# Altium schematic sheet Analog.SchDoc
size A; SheetNumber: 1; SheetTotal: 3
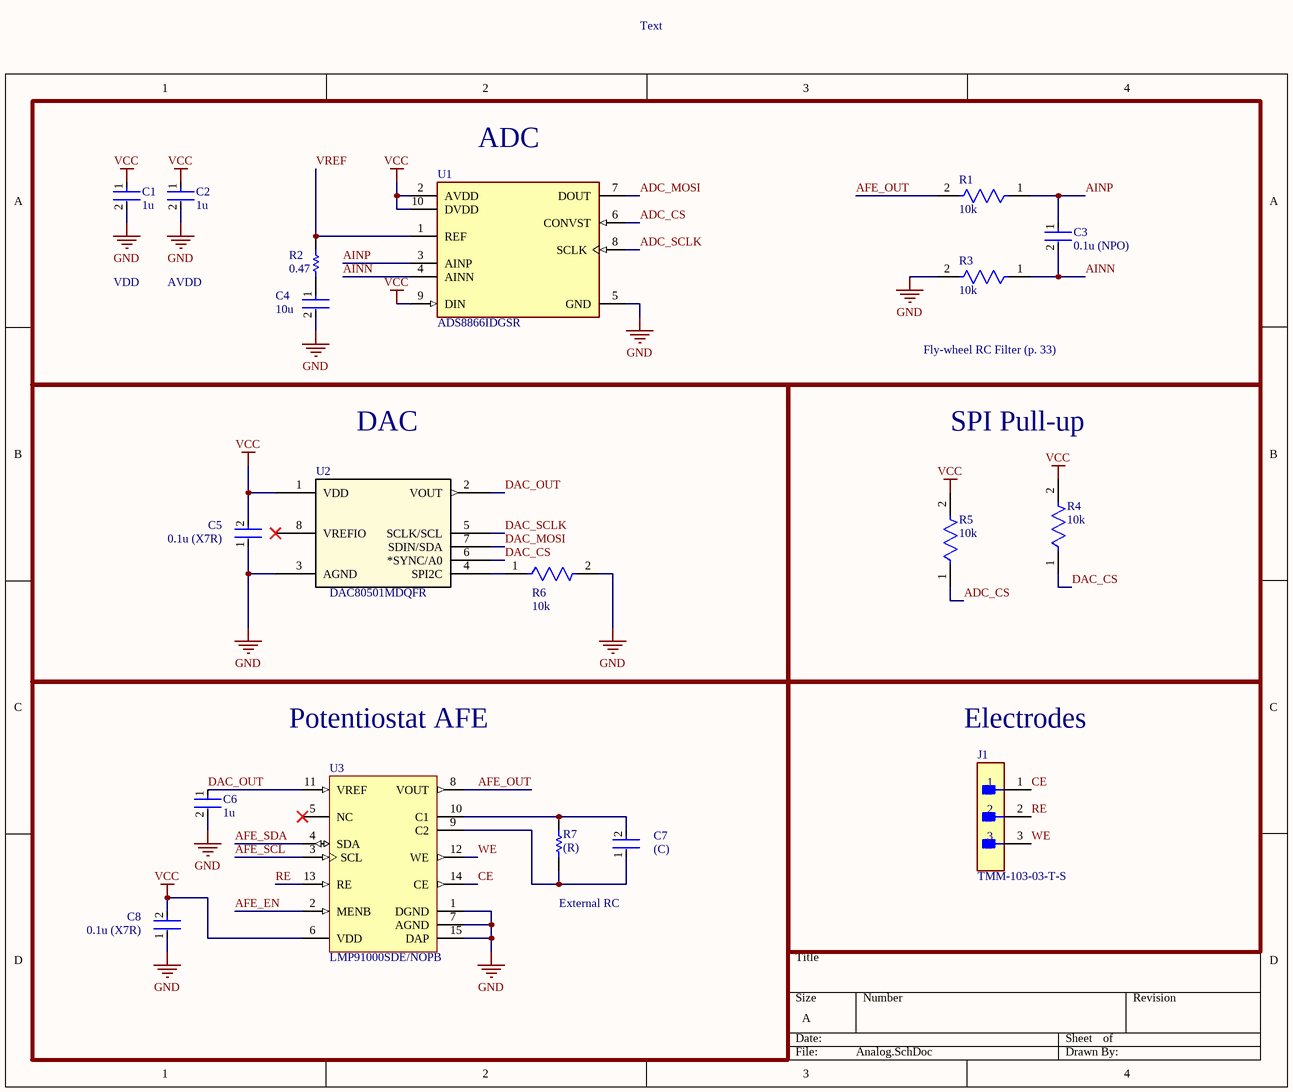
[diagram p0: Analog.SchDoc]

## Parts
C1  1u  [FP-GCM188-0_1-IPC_B]
C2  1u  [FP-GCM188-0_1-IPC_B]
C3  0.1u (NPO)  [FP-GRM319-0_15-MFG]
C4  10u  [FP-GRM21B-0_15-MFG]
C5  0.1u (X7R)  [FP-GCJ188-0_2-IPC_C]
C6  1u  [FP-GCM188-0_1-IPC_B]
C7  (C)  [FP-GCJ188-0_2-IPC_C]
C8  0.1u (X7R)  [FP-GCJ188-0_2-IPC_C]
J1  TMM-103-03-T-S  [FP-TMM-103-03-T-S-MFG]
R1  10k  [FP-CPF0603-MFG]
R2  0.47  [RESC1608X55X30ML15T15]
R3  10k  [FP-CPF0603-MFG]
R4  10k  [FP-CPF0603-MFG]
R5  10k  [FP-CPF0603-MFG]
R6  10k  [FP-CPF0603-MFG]
R7  (R)  [RESC1005X40X25NL05T10]
U1  ADS8866IDGSR  [FP-DGS0010A-IPC_A]
U2  DAC80501MDQFR  [WSON8_2P1X2P1_TEX]
U3  LMP91000SDE/NOPB  [NHL0014B_V]

## Blocks framed on the sheet
ADC: C1-C4 R1-R3 U1
DAC: C5 R6 U2
SPI Pull-up: R4 R5
Potentiostat AFE: C6-C8 R7 U3
Electrodes: J1

## Nets
GND: C1.2 C2.2 C4.2 C5.1 C6.2 C8.1 R3.2 R6.2 U1.5(GND) U2.3(AGND) U3.1(DGND) U3.7(AGND) U3.15(DAP)
VCC: C1.1 C2.1 C5.2 C8.2 R4.2 R5.2 U1.2(AVDD) U1.9(DIN) U1.10(DVDD) U2.1(VDD) U3.6(VDD)
ADC_CS: R5.1 U1.6(CONVST)
ADC_MOSI: U1.7(DOUT)
ADC_SCLK: U1.8(SCLK)
AFE_EN: U3.2(MENB)
AFE_OUT: R1.2 U3.8(VOUT)
AFE_SCL: U3.3(SCL)
AFE_SDA: U3.4(SDA)
AINN: C3.2 R3.1 U1.4(AINN)
AINP: C3.1 R1.1 U1.3(AINP)
CE: J1.1 U3.14(CE)
DAC_CS: R4.1 U2.6(*SYNC/A0)
DAC_MOSI: U2.7(SDIN/SDA)
DAC_OUT: C6.1 U2.2(VOUT) U3.11(VREF)
DAC_SCLK: U2.5(SCLK/SCL)
RE: J1.2 U3.13(RE)
VREF: R2.2 U1.1(REF)
WE: J1.3 U3.12(WE)
NetC4_1: C4.1 R2.1
NetC7_1: C7.1 R7.1 U3.9(C2)
NetC7_2: C7.2 R7.2 U3.10(C1)
NetR6_1: R6.1 U2.4(SPI2C)

Not connected (* = marked no-connect by the designer): U2 8(VREFIO)*; U3 5(NC)*

## Notes on the sheet
- Text
- VDD
- AVDD
- Fly-wheel RC Filter (p. 33)
- External RC

## Library data of the parts
C1 C2 C6 = CMP-2006-02357-2: Ceramic Capacitor for Automotive 1uF  ±10% 16VDC X7R 0603 Paper T/R; Voltage: 16V; Thickness: 0.035inch; Width: 0.031inch; Radiation Hardening: No; Depth: 0.8mm; Max Operating Temperature: 125°C; Package Quantity: 1; Ratings: AEC-Q200; Min Operating Temperature: -55°C; Packaging: Tape and Reel; Case Code (Metric): 1608; REACH SVHC: No SVHC; Dielectric: X7R; Case Code (Imperial): 0603; Length: 1.6mm; Height: 0.8mm; Voltage Rating: 16V; Termination: SMD/SMT; Case/Package: 0603; Voltage Rating (DC): 16V; Tolerance: 10%; Capacitance: 1uF; Mount: Surface Mount; Lead Free: Lead Free
C3 = CMP-06035-028588-1: Chip Multilayer Ceramic Capacitors for General Purpose, 1206, 0.10uF, C0G, 30ppm/°C, 5%, 50V
C4 = CMP-2000-07555-2: Chip Multilayer Ceramic Capacitors for General Purpose, 0805, 10uF, X7R, 15%, 10%, 10V; Length: 2mm; Case Code (Metric): 2012; Height: 1.25mm; Tolerance: 10%; Width: 1.25mm; Voltage Rating: 10V; Voltage Rating (DC): 10V; Case/Package: 0805; Package Quantity: 3000; Capacitance: 10uF; REACH SVHC: No SVHC; Case Code (Imperial): 0805; Min Operating Temperature: -55°C; Termination: SMD/SMT; Depth: 1.25mm; Mount: Surface Mount; Thickness: 0.055inch; Max Operating Temperature: 125°C; Weight: 0.000335oz; Dielectric: X7R; Packaging: Tape and Reel
C5 C7 C8 = CMP-2006-02223-2: Cap Ceramic 0.1uF 50V X7R 10% Pad SMD 0603 Soft Termination +125°C Automotive T/R; Capacitance: 100nF; Radiation Hardening: No; Dielectric: X7R; Voltage Rating (DC): 50V; Case Code (Imperial): 0603; Length: 1.6mm; Features: Soft Termination; Case Code (Metric): 1608; Case/Package: 0603; Termination: SMD/SMT; Packaging: Tape and Reel; Height: 0.8mm; Tolerance: 10%; Thickness: 0.035inch; Width: 0.031inch; Voltage Rating: 50V; Min Operating Temperature: -55°C; Ratings: AEC-Q200; Package Quantity: 1; Depth: 0.8mm; Mount: Surface Mount; Lead Free: Lead Free; Max Operating Temperature: 125°C
J1 = CMP-02766-001695-1: CONN HEADER VERT 3POS 2MM; Gender: Male; Number of Positions: 3; Max Current Rating: 3.9A; Max Voltage Rating (AC): 500V; Packaging: Bulk; RoHS Compliant: Yes; Mount: Through Hole; Length: 6mm; Contact Type: Male Pin; Package Quantity: 1; Depth: 1.97mm; Contact Material: Bronze; Insulation Material: Polymer; Series: TMM; Contact Plating: Tin; Fastening Type: Pull; Housing Color: Black; Pitch: 2mm; Termination: Solder; Contact Mating Length: 0.157inch; Min Operating Temperature: -55°C; REACH SVHC: No SVHC; Orientation: Straight; Number of Rows: 1; Color: Black; Insulation Color: Black; Connector Type: Header; Radiation Hardening: No; Number of Contacts: 3; Lead Free: Lead Free; Contact Finish - Mating: TIN; Max Operating Temperature: 105°C; Housing Material: Polymer; Contact Shape: Square
R1 R3-R6 = CMP-03211-008304-1: RES SMD 10KΩ 1% 1/16W 0603; Manufacturer Part Number: CPF0603F10KC1; Manufacturer: TE Connectivity; Voltage Rating: 50V; Temperature Coefficient: 50ppm/°C; Power Rating: 0.063W; Device Class L2: Resistors; Ipc Land Pattern Name: RESC15580X45; Device Class L3: Chip SMD Resistors; Automotive: No; Temperature Range High: +155°C; Temperature: -55°C to +155°C; Lead Free: Yes; Device Class L1: Passive Components; Tolerance: 1%; packaging: 1k Reel; ComponentLink2URL: https://www.te.com/commerce/DocumentDelivery/DDEController?Action=showdoc&DocId=Data+Sheet%7F1773200%7FM%7Fpdf%7FEnglish%7FENG_DS_1773200_M.pdf%7F3-1676481-2; octopart_url: https://octopart.com/cpf0603f10kc1-te+connectivity-42013076; Composition: Thin Film; Height: 0.55mm; RoHS: TRUE; Value: 10KΩ; Resistance: 10KΩ; Series: CPF; ComponentLink2Description: Datasheet; Category: Res; Octopart: https://octopart.com/cpf0603f10kc1-te+connectivity-42013076; Temperature Range Low: -55°C; Package: CPF0603
R2 = CMP-2000-00857-1: Manufacturer: Panasonic; Part Number: ERJ-3RQFR47V
R7 = CMP-2002-07044-1: Manufacturer: Yageo / Phycomp; Part Number: RC0402FR-073M3L
U1 = CMP-04860-000035-1: IC ADC 16BIT SAR 10VSSOP; Max Power Dissipation: 1.2mW; Sampling Rate: 100000S/s; Nominal Supply Current: 230uA; Polarity: Unipolar; Max Supply Voltage: 3.6V; Supply Type: Analog; Number of Analog Inputs: 1; Number of Bits: 16; Power Dissipation: 700uW; Interface: SPI; Signal to Noise Ratio (SNR): 93dB; Resolution: 16b; Integral Nonlinearity (INL): 2LSB; Min Supply Voltage: 2.7V; Lead Free: Lead Free; Min Operating Temperature: -40°C; Case/Package: VSSOP; Max Operating Temperature: 85°C; Packaging: Cut Tape; Package Quantity: 2500; REACH SVHC: No SVHC; Contact Plating: Gold; Mount: Surface Mount; Number of Pins: 10; RoHS Compliant: Yes; Number of A/D Converters: 1; Number of Inputs: 1
U2 = DAC80501MDQFR: True 16-bit, 1-ch, SPI/I2C, voltage-output DAC in WSON package with precision internal reference; Mfr_Name: Texas Instruments; RefDes: RefDes; Type: Type; Supplier 1: Mouser; Supplier Part Number 1: 595-DAC80501MDQFR
U3 = CMP-0064-00201-2: Configurable AFE Potentiostat for Low-Power Chemical Sensing Applications, 14-pin LLP, 250 Reel; Manufacturer: Texas Instruments; PowerWise: N; PackageTopMarking: NS*UZXYTT*L91000; CompType: OtherParts; PackageDescription: LLP, Plastic, Dual, 4 x 4 x 0.8mm Body, 14 Lead, 0.5mm Pitch, No Pullback; ComponentLink1URL: http://www.ti.com/general/docs/lit/getliterature.tsp?genericPartNumber=LMP91000&fileType=pdf; ComponentLink1Description: Datasheet URL; PinCount: 14; RoHS: Y; PackageReference: NHL0014B